# Altium schematic sheet ESC.SchDoc
size A3
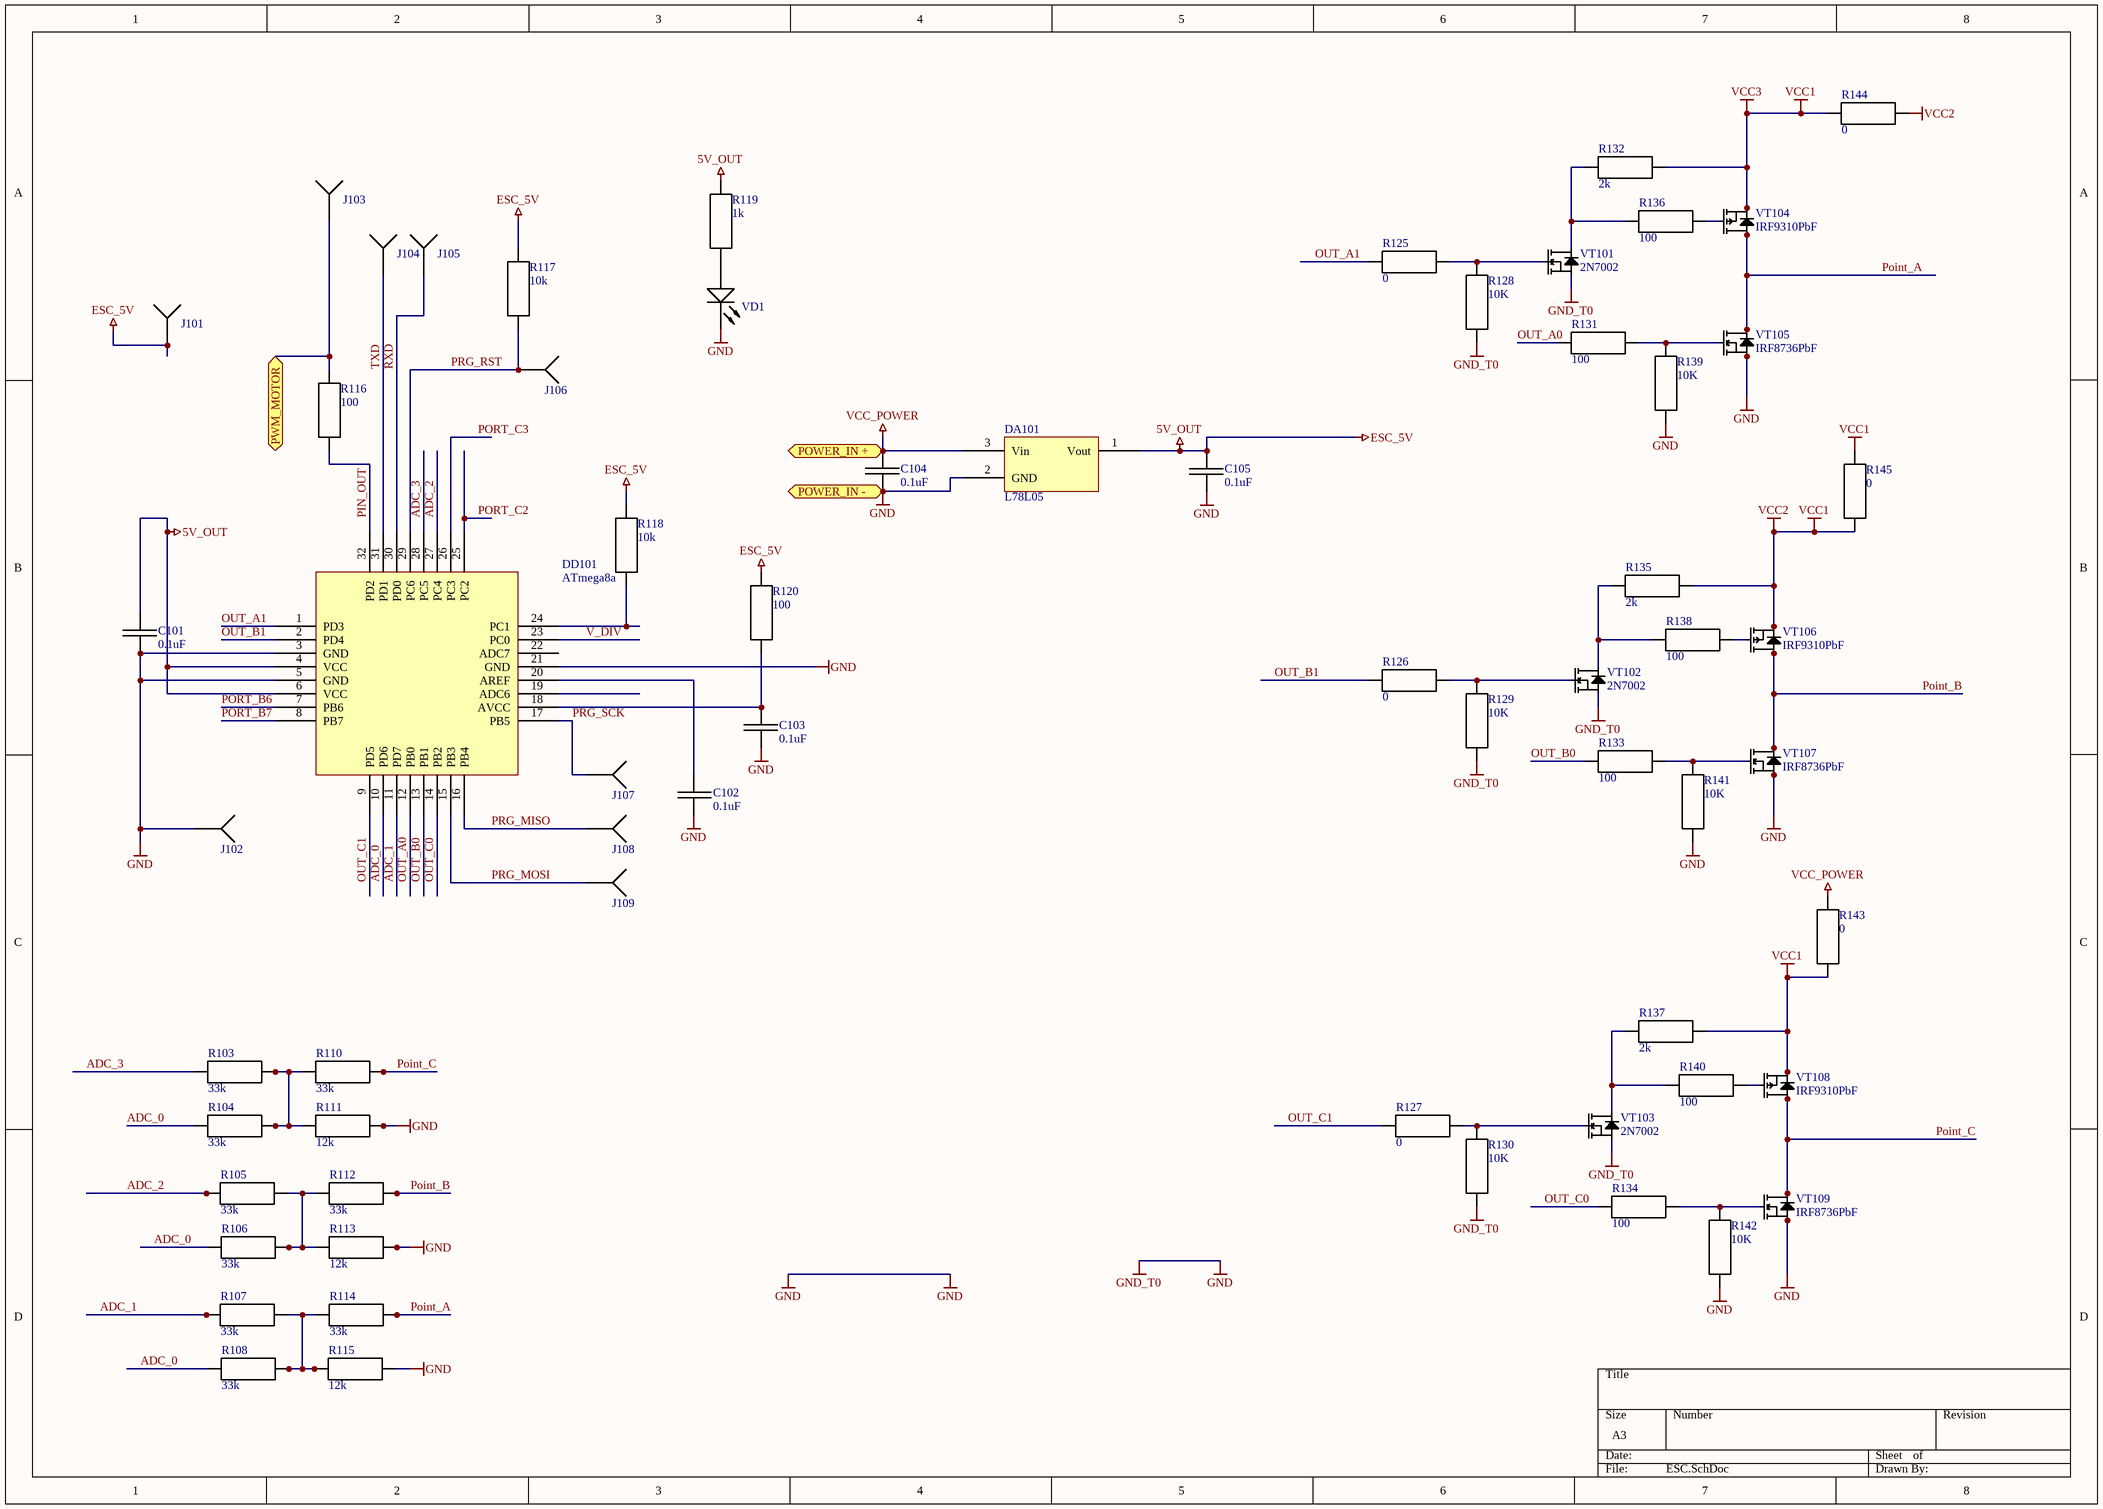
[diagram p0: ESC.SchDoc]

## Parts
C101  0.1uF  [CAP0805]
C102  0.1uF  [CAP0805]
C103  0.1uF  [CAP0805]
C104  0.1uF  [CAP0805]
C105  0.1uF  [CAP0805]
DA101  L78L05  [SOT89]
DD101  ATmega8a  [ATMEGA8A]
J101  X-Socket  [Socket]  (value not drawn)
J102  X-Socket  [Socket]  (value not drawn)
J103  X-Socket  [Socket]  (value not drawn)
J104  X-Socket  [Socket]  (value not drawn)
J105  X-Socket  [Socket]  (value not drawn)
J106  X-Socket  [Socket]  (value not drawn)
J107  X-Socket  [Socket]  (value not drawn)
J108  X-Socket  [Socket]  (value not drawn)
J109  X-Socket  [Socket]  (value not drawn)
R103  33k  [RES0603]
R104  33k  [RES0603]
R105  33k  [RES0603]
R106  33k  [RES0603]
R107  33k  [RES0603]
R108  33k  [RES0603]
R110  33k  [RES0603]
R111  12k  [RES0603]
R112  33k  [RES0603]
R113  12k  [RES0603]
R114  33k  [RES0603]
R115  12k  [RES0603]
R116  100  [RES0805]
R117  10k  [RES0805]
R118  10k  [RES0805]
R119  1k  [RES0603]
R120  100  [RES0603]
R125  0  [RES1206]
R126  0  [RES1206]
R127  0  [RES0805]
R128  10K  [RES0603]
R129  10K  [RES0603]
R130  10K  [RES0603]
R131  100  [RES0603]
R132  2k  [RES0603]
R133  100  [RES0603]
R134  100  [RES0603]
R135  2k  [RES0603]
R136  100  [RES0603]
R137  2k  [RES0603]
R138  100  [RES0603]
R139  10K  [RES0603]
R140  100  [RES0603]
R141  10K  [RES0603]
R142  10K  [RES0603]
R143  0  [RES2512]
R144  0  [RES1206]
R145  0  [RES1206]
VD1  KP-1608SURC  [Diode 1608]  (value not drawn)
VT101  2N7002  [SOT23]
VT102  2N7002  [SOT23]
VT103  2N7002  [SOT23]
VT104  IRF9310PbF  [SO-8 IRF...]
VT105  IRF8736PbF  [SO-8 IRF...]
VT106  IRF9310PbF  [SO-8 IRF...]
VT107  IRF8736PbF  [SO-8 IRF...]
VT108  IRF9310PbF  [SO-8 IRF...]
VT109  IRF8736PbF  [SO-8 IRF...]

## Ports
POWER_IN +, POWER_IN -, PWM_MOTOR

## Nets
5V_OUT: C101.1 C105.1 DA101.1(Vout) DD101.4(VCC) DD101.6(VCC) J101.1 R117.2 R118.2 R119.1 R120.2  [also labelled ESC_5V]
GND: C101.2 C102.1 C103.2 C104.2 C105.2 DA101.2(GND) DD101.3(GND) DD101.5(GND) DD101.21(GND) J102.1 R111.1 R113.1 R115.1 R128.1 R129.1 R130.1 R139.1 R141.1 R142.1 VD1.1 VT101.2(S) VT102.2(S) VT103.2(S) VT105.1(S) VT105.2(S) VT105.3(S) VT107.1(S) VT107.2(S) VT107.3(S) VT109.1(S) VT109.2(S) VT109.3(S) ; port POWER_IN -  [also labelled GND_T0]
VCC1: R132.1 R135.1 R137.1 R143.1 R144.1 R144.2 R145.1 R145.2 VT104.1(S) VT104.2(S) VT104.3(S) VT106.1(S) VT106.2(S) VT106.3(S) VT108.1(S) VT108.2(S) VT108.3(S)  [also labelled VCC2, VCC3]
VCC_POWER: C104.1 DA101.3(Vin) R143.2 ; port POWER_IN +
ADC_0: DD101.10(PD6) R104.2 R106.2 R108.2
ADC_1: DD101.11(PD7) R107.2
ADC_2: DD101.27(PC4) R105.2
ADC_3: DD101.28(PC5) R103.2
OUT_A0: DD101.12(PB0) R131.1
OUT_A1: DD101.1(PD3) R125.2
OUT_B0: DD101.13(PB1) R133.1
OUT_B1: DD101.2(PD4) R126.2
OUT_C0: DD101.14(PB2) R134.1
OUT_C1: DD101.9(PD5) R127.2
PIN_OUT: DD101.32(PD2) R116.2
Point_A: R114.1 VT104.5(D) VT104.6(D) VT104.7(D) VT104.8(D) VT105.5(D) VT105.6(D) VT105.7(D) VT105.8(D)
Point_B: R112.1 VT106.5(D) VT106.6(D) VT106.7(D) VT106.8(D) VT107.5(D) VT107.6(D) VT107.7(D) VT107.8(D)
Point_C: R110.1 VT108.5(D) VT108.6(D) VT108.7(D) VT108.8(D) VT109.5(D) VT109.6(D) VT109.7(D) VT109.8(D)
PORT_B6: DD101.7(PB6)
PORT_B7: DD101.8(PB7)
PORT_C2: DD101.25(PC2)
PORT_C3: DD101.26(PC3)
PRG_MISO: DD101.16(PB4) J108.1
PRG_MOSI: DD101.15(PB3) J109.1
PRG_RST: DD101.29(PC6) J106.1 R117.1
PRG_SCK: DD101.17(PB5) J107.1
PWM_MOTOR: J103.1 R116.1 ; port PWM_MOTOR
RXD: DD101.30(PD0) J105.1
TXD: DD101.31(PD1) J104.1
V_DIV: DD101.23(PC0)
NetC102_2: C102.2 DD101.20(AREF)
NetC103_1: C103.1 DD101.18(AVCC) R120.1
NetDD101_24: DD101.24(PC1) R118.1
NetR103_1: R103.1 R104.1 R110.2 R111.2
NetR105_1: R105.1 R106.1 R112.2 R113.2
NetR107_1: R107.1 R108.1 R114.2 R115.2
NetR119_2: R119.2 VD1.2
NetR125_1: R125.1 R128.2 VT101.1(G)
NetR126_1: R126.1 R129.2 VT102.1(G)
NetR127_1: R127.1 R130.2 VT103.1(G)
NetR131_2: R131.2 R139.2 VT105.4(G)
NetR132_2: R132.2 R136.1 VT101.3(D)
NetR133_2: R133.2 R141.2 VT107.4(G)
NetR134_2: R134.2 R142.2 VT109.4(G)
NetR135_2: R135.2 R138.1 VT102.3(D)
NetR136_2: R136.2 VT104.4(G)
NetR137_2: R137.2 R140.1 VT103.3(D)
NetR138_2: R138.2 VT106.4(G)
NetR140_2: R140.2 VT108.4(G)

Not connected (* = marked no-connect by the designer): DD101 19(ADC6) 22(ADC7)

## Library data of the parts
C101-C105 = Capacitor: Voltage: 50V; dielectric: X7R; Value: 0.1uF
DA101 = DA-L78L05: LDO; Iout: 0.1A; Vin max: 40 V; Vout: 5V
DD101 = ATmega8a: MCU 8MHz
R103-R108 R110-R120 R125-R145 = Resistor: Toleance: 1%
  R103-R108 R110 R112 R114: Value: 33k
  R111 R113 R115: Value: 12k
  R116 R120 R131 R133 R134 R136 R138 R140: Value: 100
  R117 R118: Value: 10k
  R119: Value: 1k
  R125-R127 R143-R145: Value: 0
  R128-R130 R139 R141 R142: Value: 10K
  R132 R135 R137: Value: 2k
VD1 = LED_0603: Imax: 30mA; Inorm: 20mA
VT101-VT103 = 2N7002: Vds: 60V; Rds: 2-4; Id: 300mA; Vgs: 1...2.5V
VT104 VT106 VT108 = IRF9310PbF: P-MOSFET -20A; Vds: -30V; Vgs: +-20V; Pd: 2.5W; Vgs(th): -1.3...-1.8...-2.4; Qg: 58nC; Rds(on): 0.0039...0.0046; Id: -20A
VT105 VT107 VT109 = IRF8736PbF: N-MOSFET 18A; Vds: 30V; Pd: 2.5W; Rds(on): 0.0039-0.006.8; Vgs(th): 1.35...1.8...2.35V; Qg: 17...26nC; Id: 18A